# EAGLE schematic sequential switch rev 0.8 (EAGLE 9.6.1)
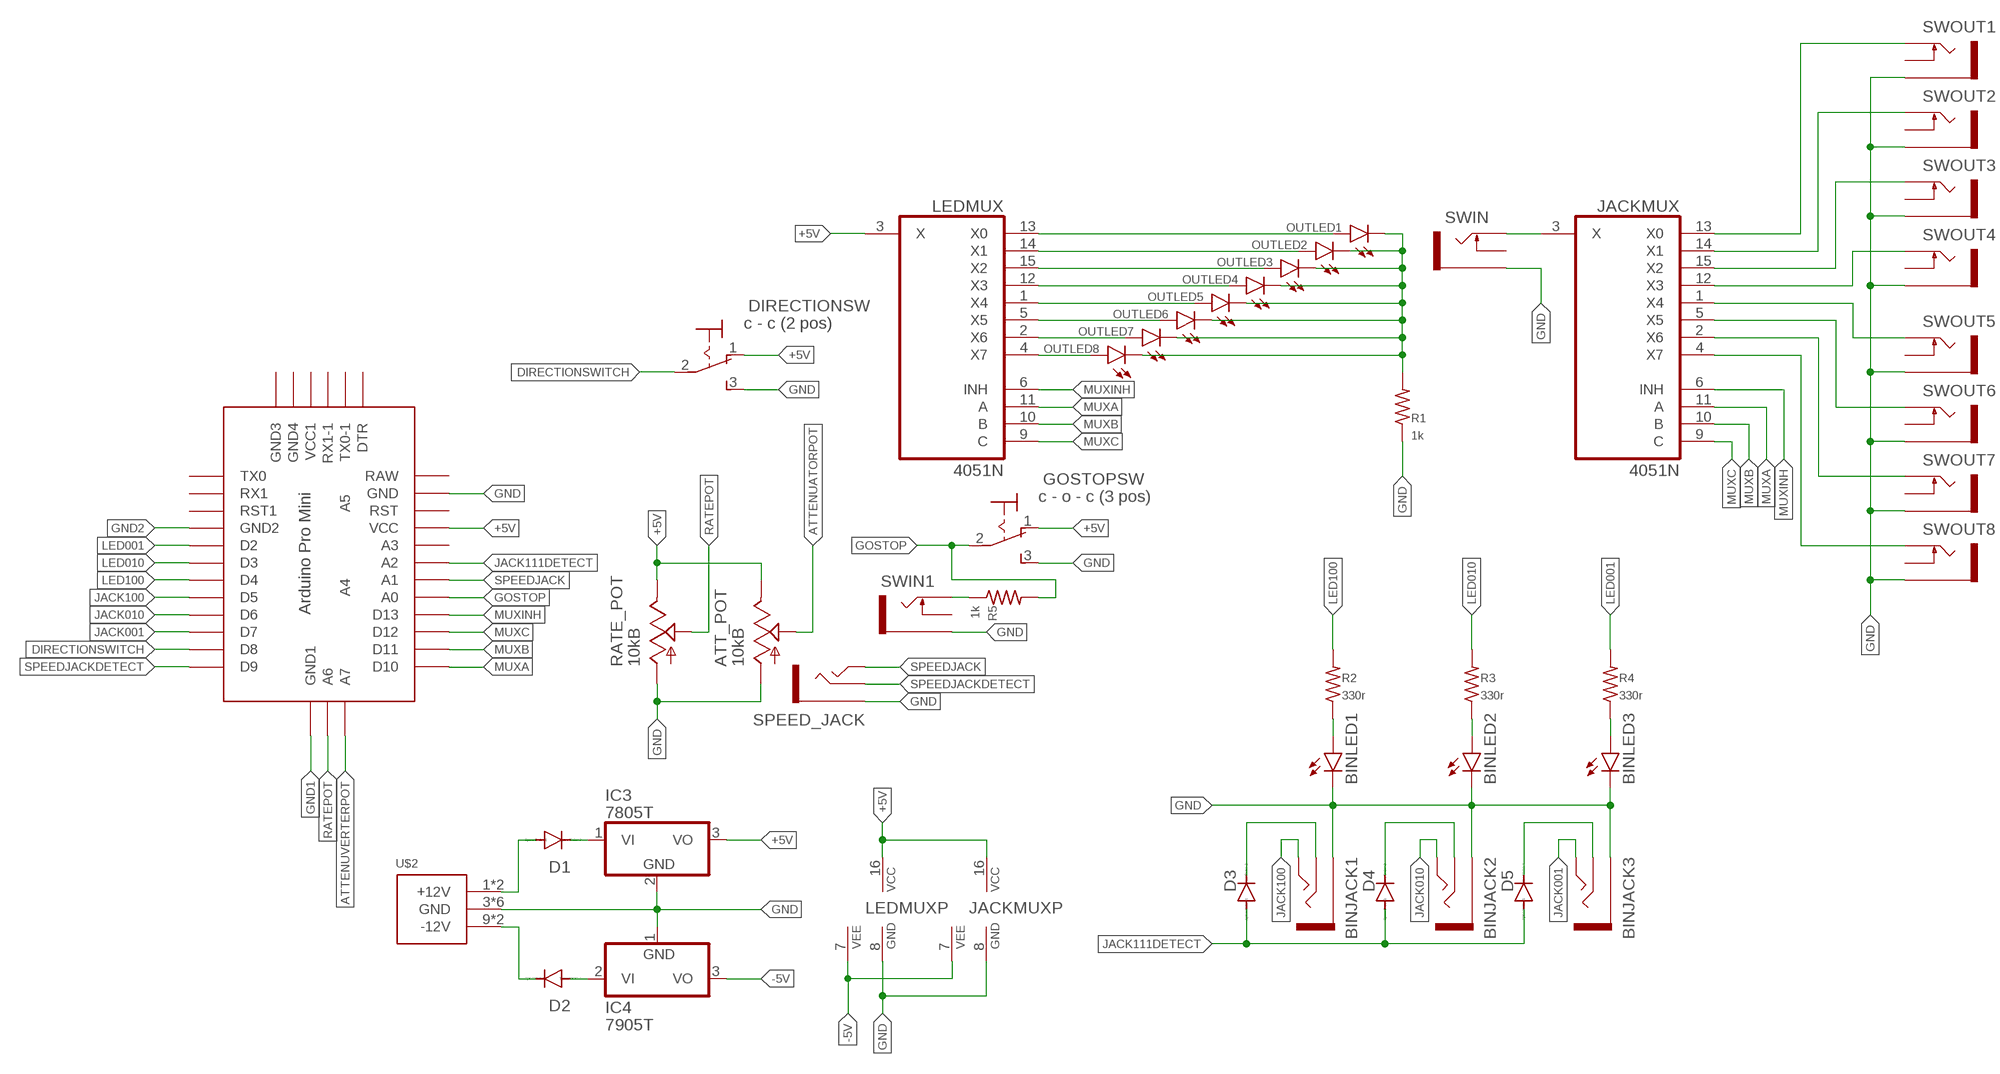
[diagram p0: schematic, sheet 1]

## Parts
ATT_POT  10kB  POT_USVERTICAL_PS  [ALPS_POT_VERTICAL_PS]
BINJACK1  JACK-STEREO  [WQP-PJ301M-12_JACK]
BINJACK2  JACK-STEREO  [WQP-PJ301M-12_JACK]
BINJACK3  JACK-STEREO  [WQP-PJ301M-12_JACK]
BINLED1  LED5MM  [LED5MM]
BINLED2  LED5MM  [LED5MM]
BINLED3  LED5MM  [LED5MM]
D1  1N4004  [DO41-10]
D2  1N4004  [DO41-10]
D3  1N4446  [DO35-10]
D4  1N4446  [DO35-10]
D5  1N4446  [DO35-10]
DIRECTIONSW  c - c (2 pos)  320-916  [320-916]
GOSTOPSW  c - o - c (3 pos)  320-916  [320-916]
IC3  7805T  [TO220H]
IC4  7905T  [TO220H]
JACKMUX  4051N  [DIL16]
LEDMUX  4051N  [DIL16]
OUTLED1  LED3MM  [LED3MM]
OUTLED2  LED3MM  [LED3MM]
OUTLED3  LED3MM  [LED3MM]
OUTLED4  LED3MM  [LED3MM]
OUTLED5  LED3MM  [LED3MM]
OUTLED6  LED3MM  [LED3MM]
OUTLED7  LED3MM  [LED3MM]
OUTLED8  LED3MM  [LED3MM]
R1  1k  R-US_0204/7  [0204/7]
R2  330r  R-US_0204/7  [0204/7]
R3  330r  R-US_0204/7  [0204/7]
R4  330r  R-US_0204/7  [0204/7]
R5  1k  R-US_0204/7  [0204/7]
RATE_POT  10kB  POT_USVERTICAL_PS  [ALPS_POT_VERTICAL_PS]
SPEED_JACK  JACK-STEREO  [WQP-PJ301M-12_JACK]
SWIN  WQP-PJ301M-12_JACK  [WQP-PJ301M-12_JACK]
SWIN1  WQP-PJ301M-12_JACK  [WQP-PJ301M-12_JACK]
SWOUT1  WQP-PJ301M-12_JACK  [WQP-PJ301M-12_JACK]
SWOUT2  WQP-PJ301M-12_JACK  [WQP-PJ301M-12_JACK]
SWOUT3  WQP-PJ301M-12_JACK  [WQP-PJ301M-12_JACK]
SWOUT4  WQP-PJ301M-12_JACK  [WQP-PJ301M-12_JACK]
SWOUT5  WQP-PJ301M-12_JACK  [WQP-PJ301M-12_JACK]
SWOUT6  WQP-PJ301M-12_JACK  [WQP-PJ301M-12_JACK]
SWOUT7  WQP-PJ301M-12_JACK  [WQP-PJ301M-12_JACK]
SWOUT8  WQP-PJ301M-12_JACK  [WQP-PJ301M-12_JACK]
U$1  ABK-PRO-MINI  [ABK-PRO-MINI]
U$2  POWER_SIMPLE  [POWER_10_NSTRIPE]

## Nets
+5V: ATT_POT.P$1(E) DIRECTIONSW.1(O) GOSTOPSW.1(O) IC3.3(VO) JACKMUX.16(VCC) LEDMUX.3(X) LEDMUX.16(VCC) RATE_POT.P$1(E) U$1.VCC
-5V: IC4.3(VO) JACKMUX.7(VEE) LEDMUX.7(VEE)
ATTENUATORPOT: ATT_POT.P$2(S)
ATTENUVERTERPOT: U$1.A7
DIRECTIONSWITCH: DIRECTIONSW.2(P) U$1.D8
GND: ATT_POT.P$3(A) BINJACK1.RING BINJACK2.RING BINJACK3.RING BINLED1.K(C) BINLED2.K(C) BINLED3.K(C) DIRECTIONSW.3(S) GOSTOPSW.3(S) IC3.2(GND) IC4.1(GND) JACKMUX.8(GND) LEDMUX.8(GND) R1.1 RATE_POT.P$3(A) SPEED_JACK.RING SWIN1.RING SWIN.RING SWOUT1.RING SWOUT2.RING SWOUT3.RING SWOUT4.RING SWOUT5.RING SWOUT6.RING SWOUT7.RING SWOUT8.RING U$1.GND U$2.3(GND) U$2.4(GND) U$2.5(GND) U$2.6(GND) U$2.7(GND) U$2.8(GND)
GND1: U$1.GND4(GND1)
GND2: U$1.GND1(GND2)
GOSTOP: GOSTOPSW.2(P) R5.2 U$1.A0
JACK001: BINJACK3.TIP U$1.D7
JACK010: BINJACK2.TIP U$1.D6
JACK100: BINJACK1.TIP U$1.D5
JACK111DETECT: D3.A D4.A D5.A U$1.A2
LED001: R4.2 U$1.D2
LED010: R3.2 U$1.D3
LED100: R2.2 U$1.D4
MUXA: JACKMUX.11(A) LEDMUX.11(A) U$1.D10
MUXB: JACKMUX.10(B) LEDMUX.10(B) U$1.D11
MUXC: JACKMUX.9(C) LEDMUX.9(C) U$1.D12
MUXINH: JACKMUX.6(INH) LEDMUX.6(INH) U$1.D13
N$1: D1.A U$2.1(+12V) U$2.2(+12V)
N$2: D2.C U$2.9(-12V) U$2.10(-12V)
N$3: LEDMUX.13(X0) OUTLED1.A
N$4: D2.A IC4.2(VI)
N$5: D1.C IC3.1(VI)
N$6: LEDMUX.14(X1) OUTLED2.A
N$7: LEDMUX.15(X2) OUTLED3.A
N$8: LEDMUX.12(X3) OUTLED4.A
N$9: LEDMUX.1(X4) OUTLED5.A
N$10: LEDMUX.5(X5) OUTLED6.A
N$11: LEDMUX.2(X6) OUTLED7.A
N$12: LEDMUX.4(X7) OUTLED8.A
N$13: OUTLED1.K(C) OUTLED2.K(C) OUTLED3.K(C) OUTLED4.K(C) OUTLED5.K(C) OUTLED6.K(C) OUTLED7.K(C) OUTLED8.K(C) R1.2
N$14: JACKMUX.13(X0) SWOUT1.TIP
N$15: JACKMUX.14(X1) SWOUT2.TIP
N$16: JACKMUX.15(X2) SWOUT3.TIP
N$17: JACKMUX.12(X3) SWOUT4.TIP
N$18: JACKMUX.1(X4) SWOUT5.TIP
N$19: JACKMUX.5(X5) SWOUT6.TIP
N$20: JACKMUX.2(X6) SWOUT7.TIP
N$21: JACKMUX.4(X7) SWOUT8.TIP
N$22: JACKMUX.3(X) SWIN.TIP
N$23: BINLED1.A R2.1
N$24: BINJACK1.SW D3.C
N$25: R5.1 SWIN1.TIP
N$27: BINLED2.A R3.1
N$29: BINJACK2.SW D4.C
N$31: BINLED3.A R4.1
N$33: BINJACK3.SW D5.C
RATEPOT: RATE_POT.P$2(S) U$1.A6
SPEEDJACK: SPEED_JACK.TIP U$1.A1
SPEEDJACKDETECT: SPEED_JACK.SW U$1.D9
Unconnected: SWIN1.SW SWIN.SW SWOUT1.SW SWOUT2.SW SWOUT3.SW SWOUT4.SW SWOUT5.SW SWOUT6.SW SWOUT7.SW SWOUT8.SW U$1.A3 U$1.A4 U$1.A5 U$1.DTR U$1.GND2(GND3) U$1.GND3(GND4) U$1.RAW U$1.RST U$1.RST1 U$1.RX1 U$1.RX1-1 U$1.TX0 U$1.TX0-1 U$1.VCC1

## Library data of the parts
ATT_POT RATE_POT = og-pots:POT_US
BINJACK1-BINJACK3 SPEED_JACK = thonkiconn:JACK-STEREO
BINLED1-BINLED3 OUTLED1-OUTLED8 = led:LED: LED OSRAM: - CHIPLED LG R971, LG N971, LY N971, LG Q971, LY Q971, LO R971, LY R971 LH N974, LH R974 LS Q976, LO Q976, LY Q976 LO Q996 - Hyper CHIPLED LW Q18S LB Q993, LB Q99A, LB R99A - SideLED LS A670, LO A670, LY A670, LG A670, LP A670 LB A673, LV A673, LT A673, LW A673 LH A674 LY A675 LS A676, LA A676, LO A676, LY A676, LW A676 LS A679, LY A679, LG A679 - Hyper Micro SIDELED® LS Y876, LA Y876, LO Y876, LY Y876 LT Y87S - SmartLED LW L88C, LW L88S LB L89C, LB L89S, LG L890 LS L89K, LO L89K, LY L89K LS L896, LA L896, LO L896, LY L896 - TOPLED LS T670, LO T670, LY T670, LG T670, LP T670 LSG T670, LSP T670, LSY T670, LOP T670, LYG T670 LG T671, LOG T671, LSG T671 LB T673, LV T673, LT T673, LW T673 LH T674 LS T676, LA T676, LO T676, LY T676, LB T676, LH T676, LSB T676, LW T676 LB T67C, LV T67C, LT T67C, LS T67K, LO T67K, LY T67K, LW E67C LS E67B, LA E67B, LO E67B, LY E67B, LB E67C, LV E67C, LT E67C LW T67C LS T679, LY T679, LG T679 LS T770, LO T770, LY T770, LG T770, LP T770 LB T773, LV T773, LT T773, LW T773 LH T774 LS E675, LA E675, LY E675, LS T675 LS T776, LA T776, LO T776, LY T776, LB T776 LHGB T686 LT T68C, LB T68C - Hyper Mini TOPLED® LB M676 - Mini TOPLED Santana® LG M470 LS M47K, LO M47K, LY M47K Source: http://www.osram.convergy.de LUXEON: - LUMILED® LXK2-PW12-R00, LXK2-PW12-S00, LXK2-PW14-U00, LXK2-PW14-V00 LXK2-PM12-R00, LXK2-PM12-S00, LXK2-PM14-U00 LXK2-PE12-Q00, LXK2-PE12-R00, LXK2-PE12-S00, LXK2-PE14-T00, LXK2-PE14-U00 LXK2-PB12-K00, LXK2-PB12-L00, LXK2-PB12-M00, LXK2-PB14-N00, LXK2-PB14-P00, LXK2-PB14-Q00 LXK2-PR12-L00, LXK2-PR12-M00, LXK2-PR14-Q00, LXK2-PR14-R00 LXK2-PD12-Q00, LXK2-PD12-R00, LXK2-PD12-S00 LXK2-PH12-R00, LXK2-PH12-S00 LXK2-PL12-P00, LXK2-PL12-Q00, LXK2-PL12-R00 Source: www.luxeon.com KINGBRIGHT: KA-3528ASYC Source: www.kingbright.com
D1 D2 = diode:1N4004: DIODE general purpose rectifier, 1 A
D3-D5 = diode:1N4446: DIODE high speed (Philips)
DIRECTIONSW GOSTOPSW = switch:320-916: TOGGLE SWITCH distributor RS Components
IC3 = linear:78*: Positive VOLTAGE REGULATOR Source: http://cache.national.com/ds/LM/LM78L05.pdf http://www.fairchildsemi.com/ds/LM/LM7805.pdf
IC4 = linear:79*: Negative VOLTAGE REGULATOR
JACKMUX LEDMUX = 40xx:4051: 8-channel ANALOG MULTIPLEXER
R1-R5 = rcl:R-US_: RESISTOR, American symbol; SPICEPREFIX: R
SWIN SWIN1 SWOUT1-SWOUT8 = thonkiconn:WQP-PJ301M-12_JACK
U$1 = Arduino-clone:ABK-PRO-MINI: ABK Pro-Mini Arduino Clone
U$2 = eurorack:POWER_SIMPLE